# Altium schematic sheet ATC9213 原理图.SchDoc
size B
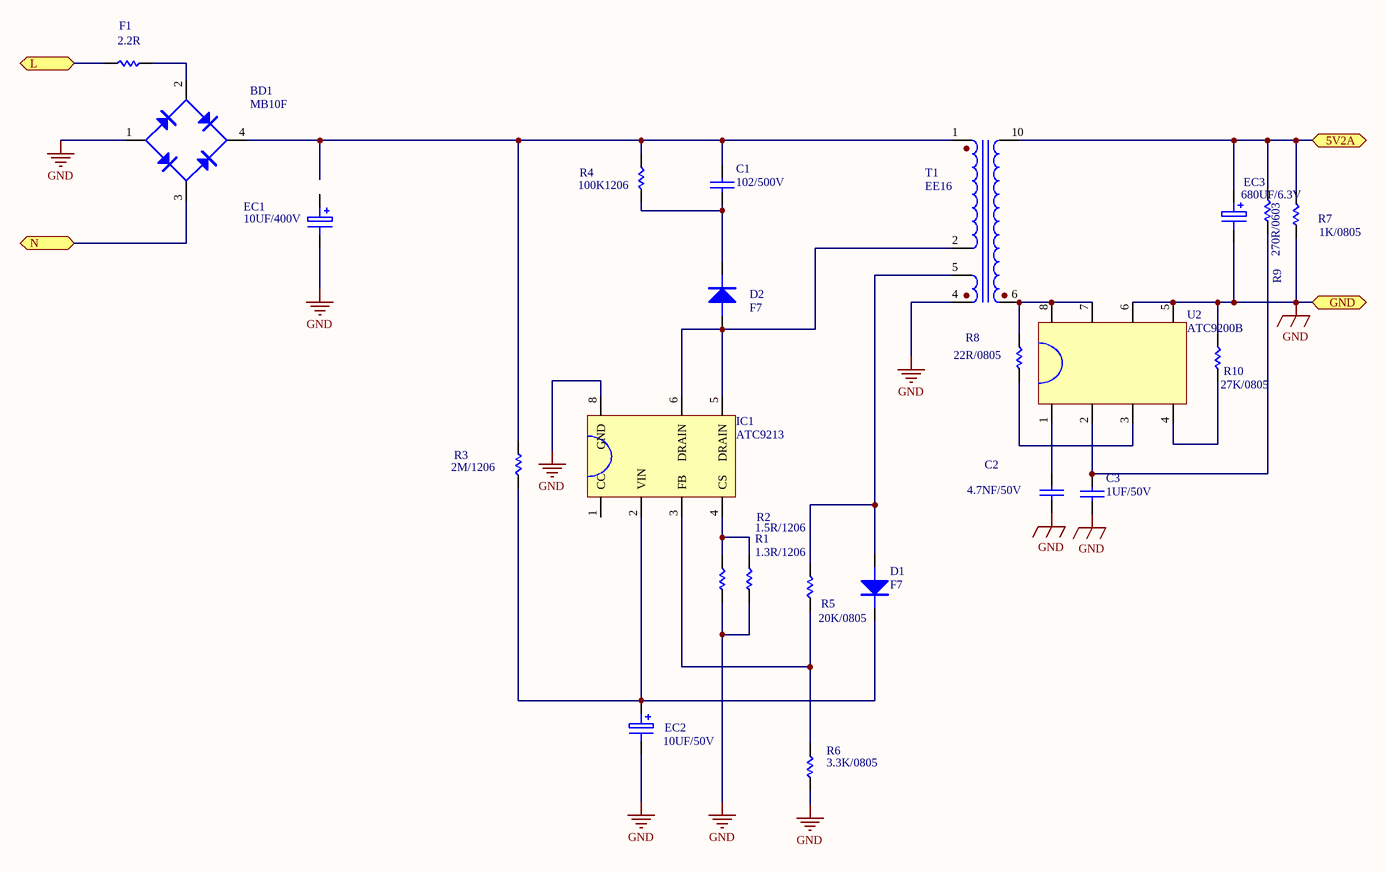
[diagram p0: ATC9213 原理图.SchDoc]

## Parts
BD1  MB10F
C1  102/500V  [CC5]
C2  4.7NF/50V  [CC5]
C3  1UF/50V  [CC5]
D1  F7  [DO-41A]
D2  F7  [DO-41A]
EC1  10UF/400V  [EC-8]
EC2  10UF/50V  [EC-5]
EC3  680UF/6.3V  [EC-6]
F1  2.2R  [R1W]
IC1  ATC9213
R1  1.3R/1206  [1206B]
R2  1.5R/1206  [1206B]
R3  2M/1206  [1206B]
R4  100K1206  [1206B]
R5  20K/0805  [0805B]
R6  3.3K/0805  [0805B]
R7  1K/0805  [0805B]
R8  22R/0805  [0805B]
R9  270R/0603  [0805B]
R10  27K/0805  [0805B]
T1  EE16  [EE13 4+4]
U2  ATC9200B

## Ports
5V2A, GND, L, N

## Nets
GND: BD1.1(V-) C2.2 C3.2 EC1.2 EC2.2 EC3.2 IC1.8(GND) R1.1 R2.1 R6.1 R7.1 R10.2 T1.4 U2.5 U2.6 ; port GND
5V2A: EC3.1 R7.2 R9.2 T1.10(F) ; port 5V2A
L: F1.2 ; port L
N: BD1.3 ; port N
NetBD1_2: BD1.2 F1.1
NetBD1_4: BD1.4(V+) C1.1 R3.1 R4.2 T1.1
NetC1_2: C1.2 D2.2(K) R4.1
NetC2_1: C2.1 U2.1
NetC3_1: C3.1 R9.1 U2.2
NetD1_1: D1.1(A) R5.1 T1.5
NetD1_2: D1.2(K) EC2.1 IC1.2(VIN) R3.2
NetD2_1: D2.1(A) IC1.5(DRAIN) IC1.6(DRAIN) T1.2
NetIC1_3: IC1.3(FB) R5.2 R6.2
NetIC1_4: IC1.4(CS) R1.2 R2.2
NetR8_1: R8.1 U2.3
NetR8_2: R8.2 T1.6(S) U2.7(\) U2.8
NetR10_1: R10.1 U2.4

Not connected (* = marked no-connect by the designer): EC1 1; IC1 1(CC)

## Library data of the parts
BD1 = BD
C1-C3 = CC
D1 D2 = D
EC1-EC3 = CE
F1 R1-R10 = R
IC1 U2 = DIP8
T1 = EFD25